# EAGLE design SmartEVSE (EAGLE 6.6.0)
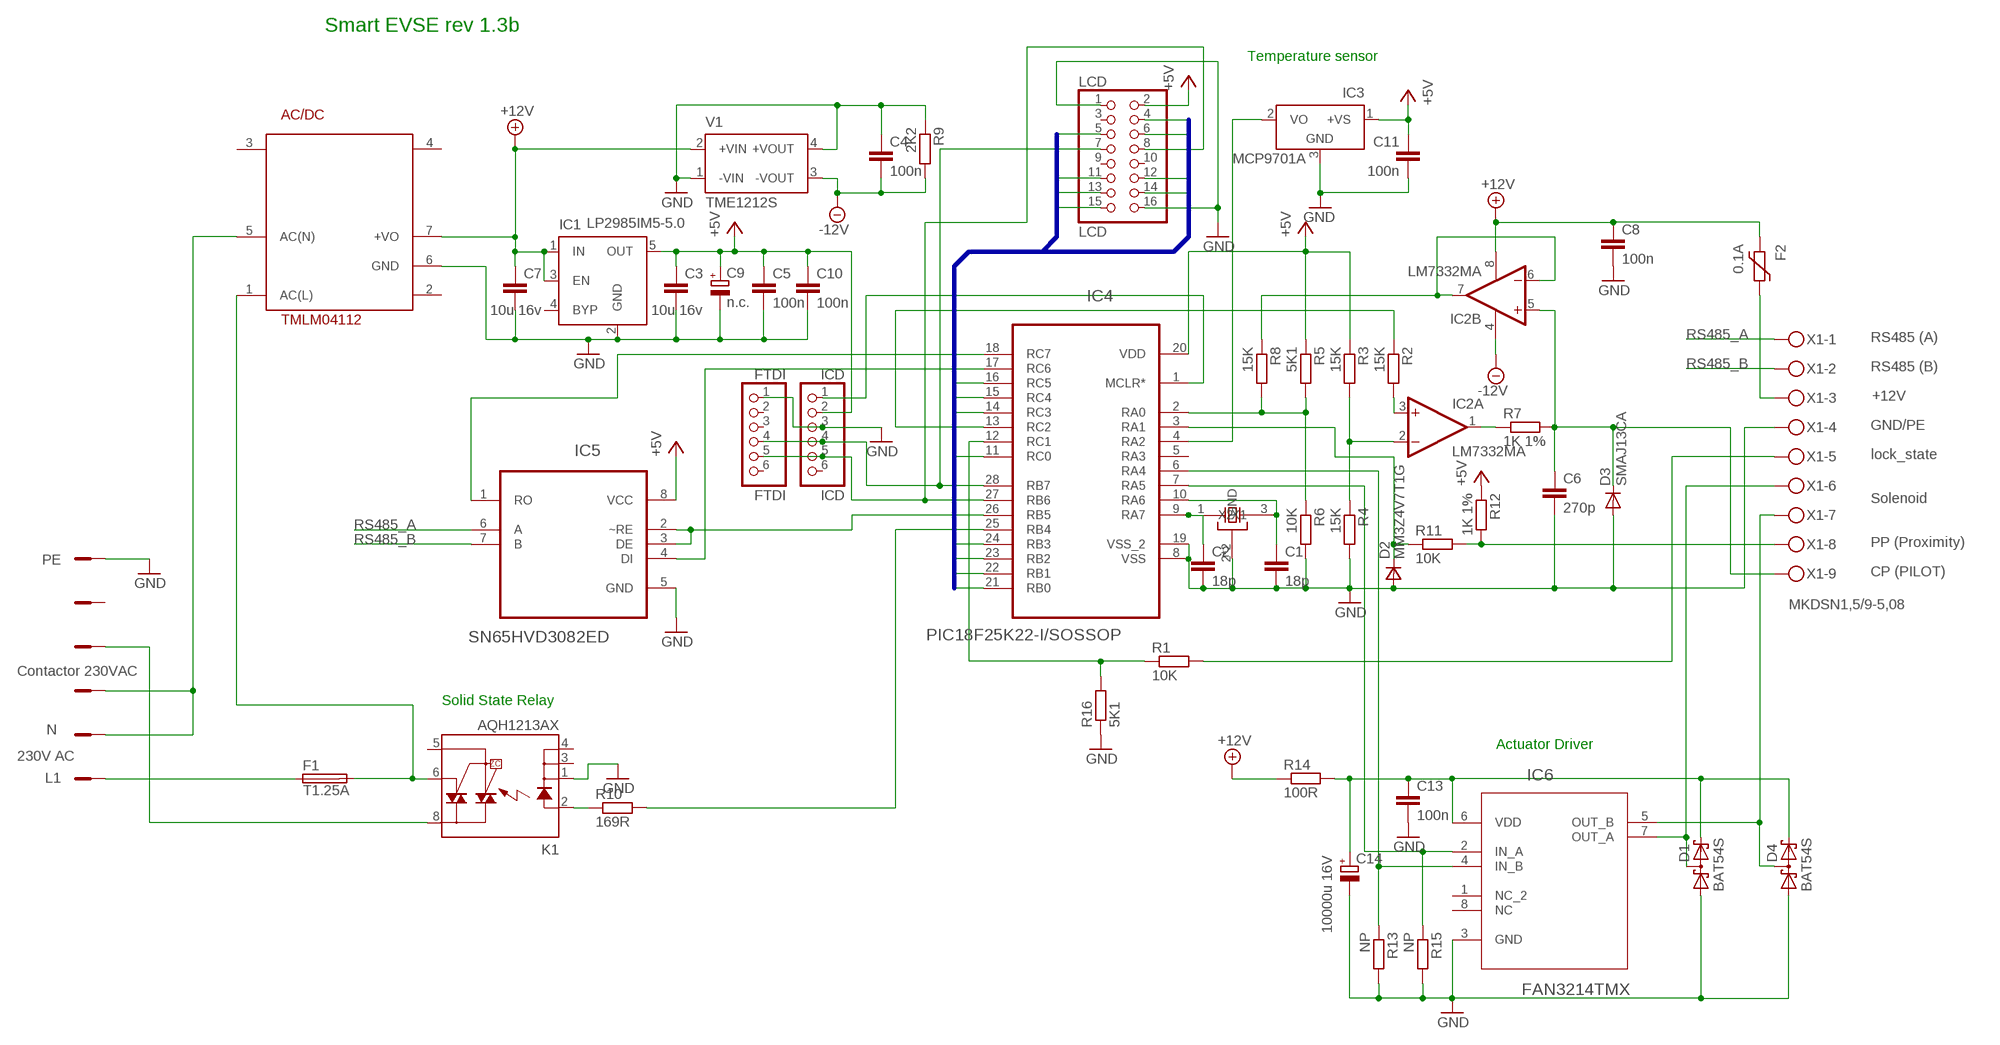
[diagram p0: schematic, sheet 1]

## Parts
AC/DC  TMLM04112  AC_DCUL  [AC/DC]
C1  18p  C-EUC0805  [C0805]
C2  18p  C-EUC0805  [C0805]
C3  10u 16v  C-EUC1206  [C1206]
C4  100n  C-EUC0805  [C0805]
C5  100n  C-EUC0805  [C0805]
C6  270p  C-EUC0805  [C0805]
C7  10u 16v  C-EUC1206  [C1206]
C8  100n  C-EUC0805  [C0805]
C9  n.c.  CPOL-EUSMCC  [SMC_C]
C10  100n  C-EUC0805  [C0805]
C11  100n  C-EUC0805  [C0805]
C13  100n  C-EUC0805  [C0805]
C14  10000u 16V  CPOL-EUE10-22.5  [EB22,5D]
D1  BAT54S  [SOT23]
D2  MM3Z4V7T1G  DSOD323  [SOD323]
D3  SMAJ13CA  DIODE-DO214AC  [DO214AC]
D4  BAT54S  [SOT23]
F1  T1.25A  TR5  [TR5]
F2  0.1A  1206L"  [1206L]
FTDI  FTDI  PINHD-1X6  [1X06]
IC1  LP2985IM5-5.0  MIC5219XX  [SOT23-5]
IC2  LM7332MA  LM1458D  [SO08]
IC3  MCP9701A  LM50  [SOT23]
IC4  PIC18F25K22-I/SOSSOP  [SOP65P780X200-28N]
IC5  SN65HVD3082ED  MAX487ECSA+  [SOIC127P600X175-8N]
IC6  FAN3214TMX  TC4424AVOA  [SOIC127P600X175-8N]
ICD  ICD  PINHD-1X6  [1X06]
K1  AQH1213AX  AQH213A  [DIL07SMD]
LCD  LCD  PINHD-2X8  [2X08]
Q1  CTS_32X25_SMD  [CTS_32X25]
R1  10K  R-EU_R0805  [R0805]
R2  15K  R-EU_R0805  [R0805]
R3  15K  R-EU_R0805  [R0805]
R4  15K  R-EU_R0805  [R0805]
R5  5K1  R-EU_R0805  [R0805]
R6  10K  R-EU_R0805  [R0805]
R7  1K 1%  R-EU_R0805  [R0805]
R8  15K  R-EU_R0805  [R0805]
R9  2K2  R-EU_R0805  [R0805]
R10  169R  R-EU_R0805  [R0805]
R11  10K  R-EU_R0805  [R0805]
R12  1K 1%  R-EU_R0805  [R0805]
R13  NP  R-EU_R0805  [R0805]
R14  100R  R-EU_R0805  [R0805]
R15  NP  R-EU_R0805  [R0805]
R16  5K1  R-EU_R0805  [R0805]
V1  TME1212S  [TME]
X1  MKDSN1,5/9-5,08  [MKDSN1,5/9-5,08]
X2  AST027-06  [P_AST027-06]

## Nets
+12V: AC/DC.7(+VO) C7.1 C8.1 F2.P$1 IC1.1(IN) IC1.3(EN) IC2.8(P:V+) R14.1 V1.2(+VIN)
-12V: C4.2 IC2.4(P:V-) R9.2 V1.3(-VOUT)
GND: AC/DC.6(GND) C1.2 C2.2 C3.2 C4.1 C5.2 C6.2 C7.2 C8.2 C9.- C10.2 C11.2 C13.2 C14.- D1.1(A1) D2.2(A) D3.A D4.1(A1) FTDI.1 IC1.2(GND) IC3.3(GND) IC4.8(VSS) IC4.19(VSS_2) IC5.5(GND) IC6.3(GND) ICD.3 K1.1(K) LCD.1 LCD.16 Q1.2(GND) Q1.4(GND) R4.2 R6.2 R9.1 R13.2 R15.2 R16.1 V1.1(-VIN) V1.4(+VOUT) X1.4 X2.P$1
LCD0: IC4.21(RB0) LCD.11
LCD1: IC4.22(RB1) LCD.12
LCD2: IC4.23(RB2) LCD.13
LCD3: IC4.24(RB3) LCD.14
LCD4: IC4.11(RC0) LCD.15
LCD6: IC4.14(RC3) LCD.4
LCD7: IC4.15(RC4) LCD.5
LCD8: IC4.16(RC5) LCD.6
N$1: IC4.12(RC1) R1.1 R16.2
N$3: IC4.6(RA4) IC6.4(IN_B) R13.1
N$5: IC4.17(RC6) IC5.4(DI)
N$6: IC4.18(RC7) IC5.1(RO)
N$7: C2.1 IC4.9(RA7) Q1.1(X1)
N$8: C1.1 IC4.10(RA6) Q1.3(X2)
N$9: IC2.2(A:-IN) R3.2 R4.1
N$10: C6.1 D3.C IC2.5(B:+IN) R7.2 X1.9
N$11: IC4.13(RC2) R2.1
N$12: IC2.3(A:+IN) R2.2
N$13: IC4.2(RA0) R5.2 R6.1 R8.2
N$14: IC2.1(A:OUT) R7.1
N$15: IC2.6(B:-IN) IC2.7(B:OUT) R8.1
N$16: D2.1(C) IC4.3(RA1) R11.1
N$17: C13.1 C14.+ D1.2(C2) D4.2(C2) IC6.6(VDD) R14.2
N$18: IC4.7(RA5) IC6.2(IN_A) R15.1
N$19: K1.2(A) R10.1
N$20: IC4.25(RB4) R10.2
N$21: AC/DC.1(AC(L)) F1.2 K1.6(DS3)
N$22: R11.2 R12.2 X1.8
N$23: K1.8(DS1) X2.P$3
N$24: F1.1 X2.P$6
N$25: IC4.26(RB5) IC5.2(~RE) IC5.3(DE)
N$26: AC/DC.5(AC(N)) X2.P$4 X2.P$5
N$27: D1.3(C1A2) IC6.7(OUT_A) X1.6
N$28: IC4.1(MCLR*) ICD.1
N$29: D4.3(C1A2) IC6.5(OUT_B) X1.7
N$31: IC3.2(VO) IC4.4(RA2)
N$32: F2.P$2 X1.3
N$33: R1.2 X1.5
N$34: FTDI.4 IC4.28(RB7) ICD.4 LCD.7
N$35: FTDI.5 IC4.27(RB6) ICD.5 LCD.8
RS485_A: IC5.6(A) X1.1
RS485_B: IC5.7(B) X1.2
VCC: C3.1 C5.1 C9.+ C10.1 C11.1 IC1.5(OUT) IC3.1(+VS) IC4.20(VDD) IC5.8(VCC) ICD.2 LCD.2 R3.1 R5.1 R12.1 ; supply symbol labelled +5V
Unconnected: AC/DC.2(NC2) AC/DC.3(NC) AC/DC.4(NC_) FTDI.2 FTDI.3 FTDI.6 IC1.4(BYP) IC4.5(RA3) IC6.1(NC_2) IC6.8(NC) ICD.6 K1.3(K1) K1.4(K2) K1.5(DS2) LCD.3 LCD.9 LCD.10 X2.P$2

## Buses
LCD[0..8]

## Notes on the sheet
- Smart EVSE rev 1.3b
- Temperature sensor
- RS485 (A)
- RS485 (B)
- +12V
- GND/PE
- lock_state
- Solenoid
- PP (Proximity)
- PE
- CP (PILOT)
- Contactor 230VAC
- Solid State Relay
- N
- Actuator Driver
- 230V AC
- L1

## Library data of the parts
AC/DC = ac_dc:AC_DC: AC/DC PSU TMLM 04112
C1-C8 C10 C11 C13 = rcl:C-EU: CAPACITOR, European symbol
C9 C14 = rcl:CPOL-EU: POLARIZED CAPACITOR, European symbol
D1 D4 = diode:BAT54S: Schottky Diodes Pin connection corrected 2011-05-04 Source: Fairchild .. BAT54.pdf
D2 = zetex:D: DIODE; MPN: CDSOD323-T05C; OC_FARNELL: 1824860; OC_NEWARK: 79R6078
D3 = diode:DIODE-: DIODE
F1 = fuse:TR5: FUSE Wickmann; OC_FARNELL: unknown; OC_NEWARK: unknown
F2 = ptc-littlefuse:1206L
FTDI ICD = pinhead:PINHD-1X6: PIN HEADER
IC1 = v-reg-micrel:MIC5219XX: VOLTAGE REGULATOR; OC_FARNELL: unknown; OC_NEWARK: unknown
IC2 = linear:*1458: OP AMP
IC3 = linear:LM50: SOT-23 Single-Supply Centigrade Temperature Sensor Vout = (10mV/°C x Temp °C) +5mmmV Source: http://cache.national.com/ds/LM/LM50.pdf
IC4 = pic_18f25k22:PIC18F25K22-I/SO: MCU 8BIT 32KB FLASH 5.5V 28SOIC
IC5 = max487:MAX487ECSA+: Low-Power, Slew-Rate-Limited RS-485/RS-422 Transceivers; MPN: MAX487ECSA+; OC_FARNELL: 9724532; OC_NEWARK: 68K4803; PACKAGE: SOIC-8; SUPPLIER: Maxim
IC6 = tc4424:TC4424AVOA: 3A Dual High-Speed Power MOSFET Drivers; DESCRIPTION: MOSFET; MPN: TC4424AVOA; OC_FARNELL: 1332307; OC_NEWARK: 56K7421; PACKAGE: SOIC-8; SUPPLIER: Microchip
K1 = relay:AQH*213: SOLID STATE RELAY NAiS Source: http://www.mew-europe.com/.. en_ds_61613_0000.pdf; OC_FARNELL: unknown; OC_NEWARK: unknown
LCD = pinhead:PINHD-2X8: PIN HEADER
Q1 = cts_crystal:CTS_32X25_SMD
R1-R16 = resistor:R-EU_: RESISTOR, European symbol
V1 = traco-electronic:TME?*: DC/DC Converter TME Series 1 Watt Source: www.tracopower.com .. tme.pdf; MPN: TME 1212S; OC_FARNELL: 1007545; OC_NEWARK: 51R5327
X1 = con-phoenix-508:MKDSN1,5/9-5,08: MKDSN 1,5/ 9-5,08 Printklemme Nennstrom: 13,5 A Nennspannung: 250 V Rastermaß: 5,08 mm Polzahl: 9 Anschlussart: Schraubanschluss Montage: Löten Anschlussrichtung Leiter/Platine: 0 ° Artikelnummer: 1729199 Source: http://eshop.phoenixcontact.com .. 1729199.pdf; MPN: SMKDSN1,5/9-5,08; OC_FARNELL: 1792912; OC_NEWARK: 70R0305
X2 = con-ria-ast027-750:AST027-06: RIA Springcon AST027-06 Grid 7,5mm Source: http://www.riaconnect.com/_assets/catalog/2008_TB_40.pdf

## Board
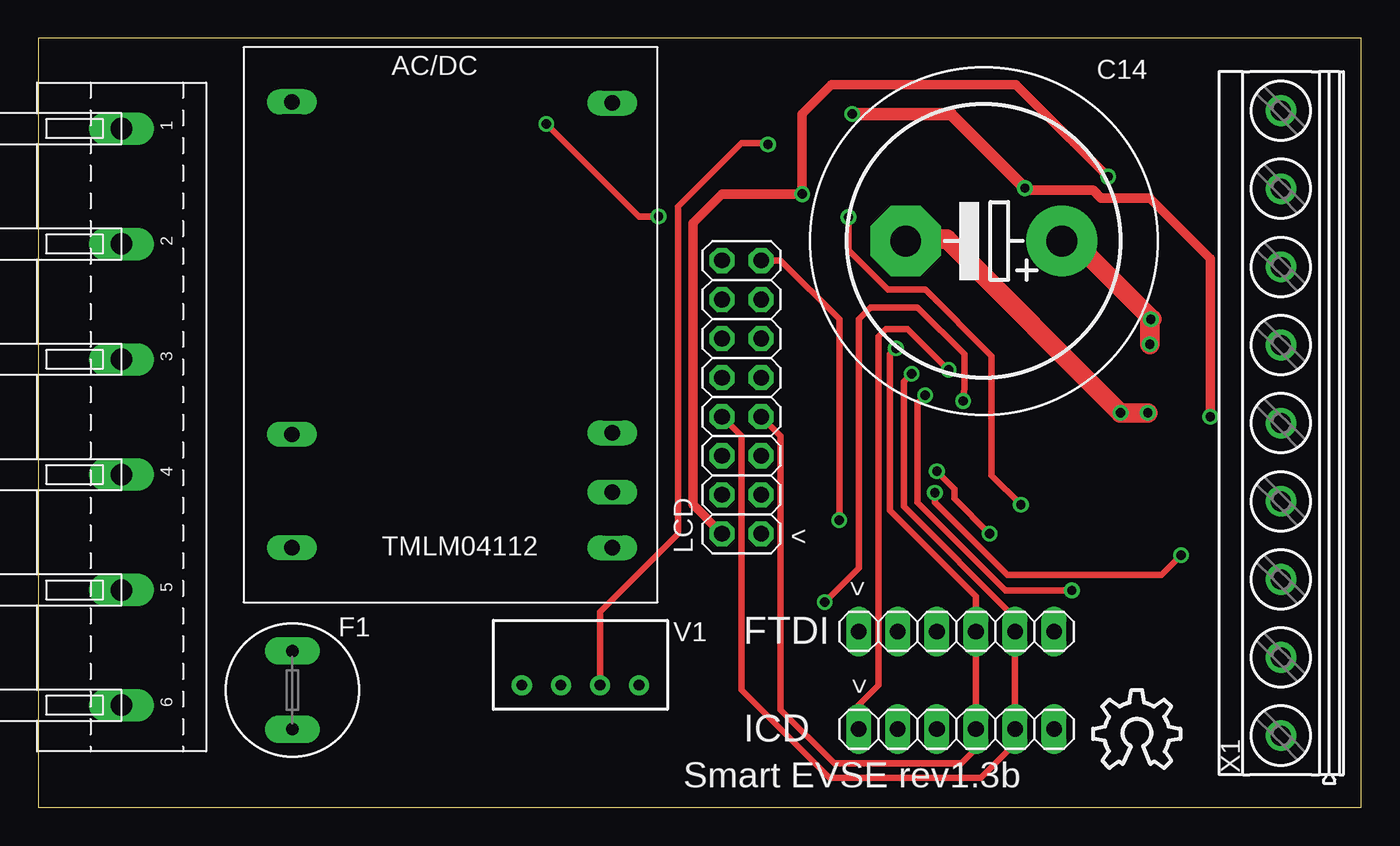
[diagram p1: board, top side]
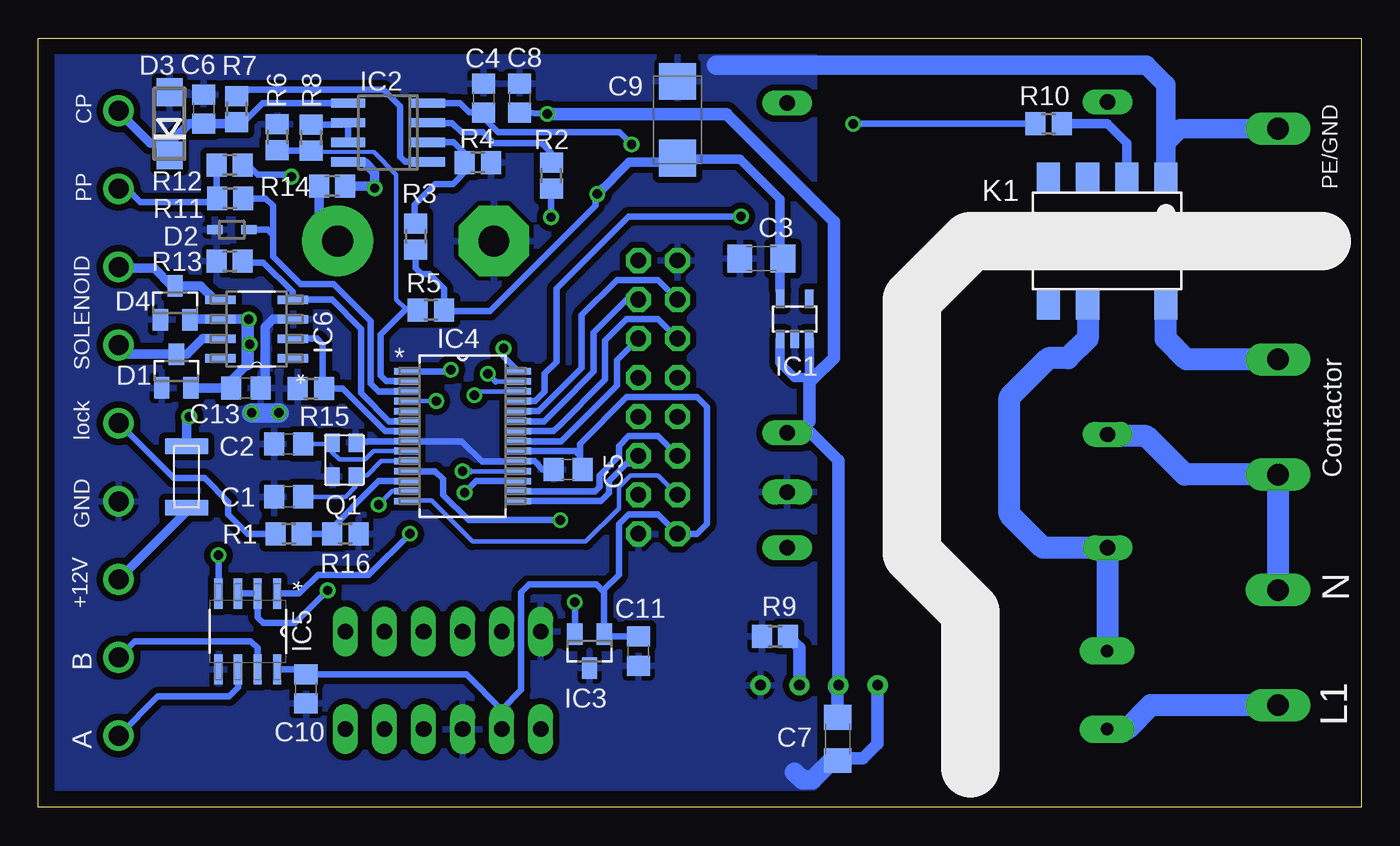
[diagram p2: board, bottom side, seen from below]

Size 86 x 50 mm. Coordinates in mm from the lower left corner, seen from the top.
Outline: 0,0 86,0 86,50 0,50 0,0
Copper layers (1*16): Top 0.035mm / dielectric 1.5mm / Bottom 0.035mm
Design rules "default": minimum track width 10mil, minimum drill 24mil, track to track 8mil, track to pad 8mil, pad to pad 8mil, via to via 8mil, smd to smd 8mil, copper to edge 40mil, drill to drill 8mil, minimum pad ring 12mil, minimum via ring 8mil, stop-mask expansion 4mil, vias tented up to drill 0mil, thermal gap 12mil

### Footprints (pad centres in the part's own frame; a part is rotated, then mirrored left to right if it is on the bottom)
AC/DC = drill 1 long: 1 3.14,3.54; 2 23.98,3.54; 3 3.14,32.54; 4 23.97,32.46; 5 3.14,10.91; 6 23.98,7.16; 7 23.98,11.01
C0805 = smd 1.3 x 1.5: 1 -0.95,0; 2 0.95,0
C1206 = smd 1.6 x 1.8: 1 -1.4,0; 2 1.4,0
SMC_C = smd 2.4 x 2.4: + -2.5,0; - 2.5,0
EB22,5D = drill 2.007 pad 4.597: + -5.08,0 | drill 2.007 pad 4.597 octagon: - 5.08,0
SOT23 = smd 1 x 1.4: 1 -0.95,-1.1; 2 0.95,-1.1; 3 0,1.1
SOD323 = smd 1 x 0.6: 1 -1.1,0; 2 1.1,0
DO214AC = smd 1.8 x 1.7: A 2.05,0; C -2.05,0
TR5 = drill 0.813 pad 1.778 long: 1 -2.54,0; 2 2.54,0
1206L = smd 1 x 2.8: P$1 -2,0; P$2 2,0
1X06 = drill 1.016 long: 1 -6.35,0; 2 -3.81,0; 3 -1.27,0; 4 1.27,0; 5 3.81,0; 6 6.35,0
SOT23-5 = smd 0.55 x 1.2: 1 -0.95,-1.3; 2 0,-1.3; 3 0.95,-1.3; 4 0.95,1.3; 5 -0.95,1.3
SO08 = smd 0.6 x 2.2: 1 -1.905,-2.6; 2 -0.635,-2.6; 3 0.635,-2.6; 4 1.905,-2.6; 5 1.905,2.6; 6 0.635,2.6; 7 -0.635,2.6; 8 -1.905,2.6
SOP65P780X200-28N = smd 1.651 x 0.432: 1 -3.632,4.216; 2 -3.632,3.581; 3 -3.632,2.921; 4 -3.632,2.286; 5 -3.632,1.626; 6 -3.632,0.965; 7 -3.632,0.33; 8 -3.632,-0.33; 9 -3.632,-0.965; 10 -3.632,-1.626; 11 -3.632,-2.286; 12 -3.632,-2.921; 13 -3.632,-3.581; 14 -3.632,-4.216; 15 3.632,-4.216; 16 3.632,-3.581; 17 3.632,-2.921; 18 3.632,-2.286; 19 3.632,-1.626; 20 3.632,-0.965; 21 3.632,-0.33; 22 3.632,0.33; 23 3.632,0.965; 24 3.632,1.626; 25 3.632,2.286; 26 3.632,2.921; 27 3.632,3.581; 28 3.632,4.216
SOIC127P600X175-8N = smd 1.981 x 0.533: 1 -2.464,1.905; 2 -2.464,0.635; 3 -2.464,-0.635; 4 -2.464,-1.905; 5 2.464,-1.905; 6 2.464,-0.635; 7 2.464,0.635; 8 2.464,1.905
SOIC127P600X175-8N' = smd 1.981 x 0.559: 1 -2.362,1.905; 2 -2.362,0.635; 3 -2.362,-0.635; 4 -2.362,-1.905; 5 2.362,-1.905; 6 2.362,-0.635; 7 2.362,0.635; 8 2.362,1.905
DIL07SMD = smd 1.5 x 1.9: 1 -3.81,-4.15; 2 -1.27,-4.15; 3 1.27,-4.15; 4 3.81,-4.15; 5 3.81,4.15; 6 1.27,4.15; 8 -3.81,4.15
2X08 = drill 1.016 octagon: 1 -8.89,-1.27; 2 -8.89,1.27; 3 -6.35,-1.27; 4 -6.35,1.27; 5 -3.81,-1.27; 6 -3.81,1.27; 7 -1.27,-1.27; 8 -1.27,1.27; 9 1.27,-1.27; 10 1.27,1.27; 11 3.81,-1.27; 12 3.81,1.27; 13 6.35,-1.27; 14 6.35,1.27; 15 8.89,-1.27; 16 8.89,1.27
CTS_32X25 = smd 1.2 x 0.9: 1 -1.1,-0.7; 2 1.1,-0.7; 3 1.1,0.8; 4 -1.1,0.8
R0805 = smd 1.3 x 1.5: 1 -0.85,0; 2 0.85,0
TME = drill 0.7 pad 1.1: 1 -3.81,0; 2 -1.27,0; 3 1.27,0; 4 3.81,0
MKDSN1,5/9-5,08 = drill 1.3 pad 2: 1 -20.341,0.025; 2 -15.261,0.025; 3 -10.181,0.025; 4 -5.101,0.025; 5 -0.021,0.025; 6 5.059,0.025; 7 10.139,0.025; 8 15.219,0.025; 9 20.299,0.025
P_AST027-06 = drill 1.4 long: P$1 -19.05,0; P$2 -11.55,0; P$3 -4.05,0; P$4 3.45,0; P$5 10.95,0; P$6 18.45,0

### Placement (x,y rotation side)
AC/DC  13.34,13.34 0 top
C1  69.72,20.19 180 bottom
C2  69.72,23.62 180 bottom
C3  38.99,35.69 180 bottom
C4  57.05,46.12 270 bottom
C5  51.56,21.97 180 bottom
C6  75.25,45.4 90 bottom
C7  34.04,4.45 270 bottom
C8  54.71,46.12 90 bottom
C9  44.45,44.7 90 bottom
C10  68.61,7.7 270 bottom
C11  46.99,10.16 270 bottom
C13  72.51,27.26 0 bottom
C14  61.47,36.83 180 top
D1  77.03,28.37 0 bottom
D2  73.43,37.56 180 bottom
D3  77.47,44.45 90 bottom
D4  77.11,32.81 0 bottom
F1  16.51,7.62 90 top
F2  76.37,21.49 270 bottom
FTDI  59.69,11.43 0 top
IC1  36.83,31.75 0 bottom
IC2  63.27,43.88 90 bottom
IC3  50.16,10.16 180 bottom
IC4  58.42,24.13 0 bottom
IC5  72.39,11.43 270 bottom
IC6  FAN3214TMX  [SOIC127P600X175-8N']  71.81,31.1 180 bottom
ICD  59.69,5.08 0 top
K1  16.51,36.83 180 bottom
LCD  45.72,26.67 90 top
Q1  66.17,22.61 270 bottom
R1  69.72,17.78 180 bottom
R2  52.65,41.08 90 bottom
R3  61.47,37.12 90 bottom
R4  57.43,41.93 0 bottom
R5  60.49,32.35 180 bottom
R6  70.47,43.59 90 bottom
R7  73.11,45.4 270 bottom
R8  68.27,43.55 270 bottom
R9  38.1,11.11 0 bottom
R10  20.32,44.45 180 bottom
R11  73.54,39.6 180 bottom
R12  73.56,41.76 180 bottom
R13  73.56,35.52 180 bottom
R14  66.91,40.4 180 bottom
R15  68.29,27.22 180 bottom
R16  66.04,17.78 180 bottom
U$1  [OSHW_10X200_NOTEXT]  68.58,2.54 0 top
V1  35.24,7.94 0 top
X1  80.82,25 90 top
X2  5.4,25.08 270 top

### Tracks (layer width: path | path; a pad name or v marks a point on that pad's centre or on a via)
+12V  (via drill 0.61)
  Top 0.61: v76.2,25.4 76.2,35.69 72.26,39.62 69.09,39.62 68.58,40.13 64.27,40.13 v64.14,40.26
  Top 0.813: v52.91,45.09 59.32,45.09 v64.14,40.26
  Bottom 0.305: 35.62,27.88 35.56,27.94
  Bottom 0.406: C8.1 54.26,45.17 v52.91,45.09 | IC2.8 64.83,41.98 64.77,41.91
  Bottom 0.61: F2.P$1 76.37,25.23 v76.2,25.4 | IC1.1 37.78,28.89 36.83,27.94 36.2,27.94 35.88,27.62 | IC1.3 35.88,28.26 35.56,27.94 | 64.77,41.91 64.14,41.28 v64.14,40.26 64.28,40.4 R14.1
  Bottom 0.813: v52.91,45.09 41.27,45.09 34.29,38.1 34.29,29.21 35.56,27.94 35.88,27.62 35.88,25.08 36.2,24.77 | AC/DC.7 36.62,24.34 36.2,24.77 | V1.2 33.97,22.54 36.2,24.77 | 34.04,7.87 C7.1
  Bottom 1.27: 34.04,7.87 V1.2
-12V  (via drill 0.61)
  Top 0.406: V1.3 36.51,12.7 41.59,17.78 41.59,39.05 45.72,43.18 47.37,43.18 v47.43,43.12
  Bottom 0.406: IC2.4 58.59,45.78 58,45.2 57.08,45.2 C4.2 57.05,44.85 56.1,43.9 48.22,43.9 v47.43,43.12
  Bottom 0.813: V1.3 36.51,10.38 R9.2
GND  (via drill 0.61)
  Top 1.27: v72.14,25.65 v70.36,25.65 59.05,36.96 57.78,36.96 C14.-
  Bottom 0.305: C14.- 57.15,36.83
  Bottom 0.406: C5.2 53.21,21.97 53.75,22.5 IC4.19 54.81,22.48 57.15,22.48 58.47,23.8 IC4.8 65.27,23.8 Q1.4
  Bottom 0.61: IC6.3 70.75,31.74 71.25,31.24 71.25,27.57 C13.2
  Bottom 0.813: V1.1 31.43,4.13 32.38,3.17 33.91,3.17 C7.2
  Bottom 1.27: v70.36,25.65 v72.14,25.65 | X2.P$1 11.75,44.13 12.7,43.18 K1.1 12.7,46.99 13.97,48.26 41.91,48.26 | C7.2 34.42,3.04 35.69,1.78 36.32,1.78 36.83,2.29
  pour Bottom (isolate 0.406): 35.56,49.53 85.09,49.53 85.09,1.27 35.56,1.27
LCD0
  Bottom 0.406: LCD.11 48.39,29.08 48.39,27.43 52.02,23.8 IC4.21
LCD1
  Bottom 0.406: LCD.12 45.72,31.75 47.75,31.75 49.15,30.35 49.15,27.81 52.2,24.77 52.5,24.46 IC4.22
LCD2
  Bottom 0.406: LCD.13 47.75,33.02 49.91,30.86 49.91,28.32 52.2,26.04 53.14,25.09 IC4.23
LCD3
  Bottom 0.305: 54.76,25.78 IC4.24
  Bottom 0.406: LCD.14 45.72,34.29 48.39,34.29 50.67,32 50.67,28.57 53.47,25.78 54.76,25.78
LCD4  (via drill 0.61)
  Top 0.406: LCD.15 48.26,35.56 52.07,31.75 v52.07,18.67
  Bottom 0.406: IC4.11 60.2,21.84 59.69,21.34 59.69,20.32 58.04,18.67 v52.07,18.67
LCD6
  Bottom 0.305: LCD.4 45.72,21.59 47.5,21.59 48.26,20.83 48.26,19.43 50.42,17.27 57.78,17.27 60.45,19.94 62.03,19.94 IC4.14
LCD7
  Bottom 0.406: LCD.5 47.5,22.35 47.75,22.35 48.9,21.21 48.9,20.45 49.43,19.91 IC4.15
LCD8
  Bottom 0.406: LCD.6 45.72,24.13 47.62,24.13 48.26,23.5 48.26,22.86 49.53,21.59 49.53,20.83 49.81,20.55 IC4.16
N$1
  Bottom 0.406: IC4.12 63.88,21.21 67.31,17.78 | 67.31,17.78 R1.1 69,17.78 | 67.31,17.78 R16.2
N$3
  Bottom 0.406: 69.37,33.08 IC6.4 | IC6.4 69.84,33.01 | IC6.4 69.47,33.03 69.47,33.53 71.37,35.43 72.63,35.43 R13.1 | IC6.4 66.92,33.01 65.02,31.11 65.02,26.92 63.2,25.09 IC4.6
N$5  (via drill 0.61)
  Top 0.406: v74.3,16.38 73.03,15.11 62.99,15.11 58.29,19.81 v58.29,20.45
  Bottom 0.406: IC5.4 74.3,14.8 v74.3,16.38 | IC4.17 57.53,21.21 v58.29,20.45
N$6  (via drill 0.61)
  Top 0.406: v61.85,17.78 59.56,20.07 59.56,20.7 v58.42,21.84
  Bottom 0.305: IC4.18 57.91,21.84
  Bottom 0.406: IC5.1 69.04,13.89 67.82,15.11 64.52,15.11 v61.85,17.78 | v58.42,21.84 57.91,21.84
N$7
  Bottom 0.305: IC4.9 64.21,23.16 64.77,22.61 66.42,22.61 66.93,23.11 66.93,23.64 Q1.1 66.95,23.62 C2.1
N$8
  Bottom 0.305: IC4.10 63.73,22.5 64.64,21.59 65.28,21.59 Q1.3 65.37,20.87 66.04,20.19 C1.1
N$9
  Bottom 0.406: 61.05,43.24 IC2.2 58.99,43.24 58.29,42.55 58.29,41.94 R4.1 58.28,41.29 59.05,40.51 60.22,40.51 61.54,39.19 61.54,38.05 R3.2
N$10
  Bottom 0.406: IC2.5 71.42,45.78 72.4,44.8 72.86,44.8 R7.2
  Bottom 0.61: R7.2 72.81,44.45 C6.1 76.2,44.45 77.47,43.18 | 77.47,43.18 D3.C | X1.9 80.8,45.23 78.74,43.18 77.47,43.18
N$11  (via drill 0.61)
  Top 0.406: v52.67,38.38 52.67,36.23 55.24,33.66 57.66,33.66 61.98,29.34 61.98,21.59 v63.88,19.68
  Bottom 0.305: IC4.13 62.08,20.57 62.99,20.57 v63.88,19.68
  Bottom 0.406: v52.67,38.38 52.67,39.01 R2.1
N$12
  Bottom 0.406: 60.59,44.52 IC2.3 60.66,44.5 59.1,44.5 58.5,43.9 57.1,43.9 56.4,43.2 53.3,43.2 52.7,42.6 52.7,41.98 R2.2
N$13
  Bottom 0.254: 67.84,42.6 67.84,42.65 67.82,42.67 | 64.19,42.61 68.17,42.61 R8.2
  Bottom 0.305: R8.2 67.94,42.7 67.84,42.6 | 64.19,42.61 62.74,41.15 62.74,33.02 62.1,32.38 61.38,32.38 R5.2 61.41,31.88
  Bottom 0.406: R8.2 70.41,42.7 R6.1 | IC4.2 63.4,27.71 63.75,28.07 63.75,30.73 62.1,32.38
N$14
  Bottom 0.406: R7.1 72.29,46.67 63.57,46.67 62.5,45.6 62.5,42.3 62.17,41.98 IC2.1
N$15
  Bottom 0.406: IC2.7 IC2.6 65.99,44.4 R8.1
N$16
  Bottom 0.406: R11.1 71.22,39.6 70.74,39.12 70.74,37.21 | IC4.3 63.88,27.05 64.39,27.56 64.39,31.62 66.8,34.04 68.96,34.04 70.74,35.81 70.74,37.21 | D2.1 71.09,37.56 70.74,37.21
N$17  (via drill 0.61)
  Top 1.27: v72.26,30.1 72.26,31.62 72.39,31.75 67.56,36.58 66.8,36.58 C14.+
  Bottom 0.61: v72.33,31.73 v72.33,31.74 IC6.6 76.13,31.74 D4.2 | 72.41,28.81 73.41,27.81 73.41,27.31 C13.1 D1.2 | R14.2 67.75,38.04 C14.+
  Bottom 0.813: v72.33,31.73 72.41,31.65 72.41,30.24 v72.26,30.1 72.41,29.95 72.41,28.81
N$18
  Bottom 0.406: IC6.2 67.89,30.47 67.51,30.08 67.51,27.29 R15.1 | R15.1 67.4,27.18 67.27,27.05 | IC4.7 63.45,24.46 66.21,27.22 R15.1
N$19
  Bottom 0.61: R10.1 16.51,44.45 15.24,43.18 K1.2
N$20  (via drill 0.61)
  Top 0.406: v33.02,44.45 39.05,38.42 v40.32,38.42
  Bottom 0.406: R10.2 v33.02,44.45 | v40.32,38.42 47.62,38.42 52.32,33.72 52.32,28.96 53.09,28.19 53.09,27.05 53.72,26.42 IC4.25
N$21
  Bottom 1.422: K1.6 17.78,30.48 19.05,29.21 20.32,29.21 22.86,26.67 22.86,19.05 20.68,16.88 AC/DC.1 16.51,16.88 F1.2
N$22
  Bottom 0.406: R12.2 74.41,39.61 R11.2 74.62,39.37 79.38,39.37 80.22,40.22 X1.8
N$23
  Bottom 1.422: X2.P$3 11.35,29.13 12.7,30.48 K1.8
N$24
  Bottom 1.422: X2.P$6 13.69,6.63 15.24,5.08 F1.1
N$25  (via drill 0.61)
  Top 0.406: v67.2,14.1 62.86,14.1 57.15,19.81 57.15,26.29 v57.66,26.8
  Bottom 0.305: IC4.26 57.4,27.05 v57.66,26.8
  Bottom 0.406: IC5.3 IC5.2 71.75,12.36 71.4,12 69.3,12 v67.2,14.1
N$26
  Bottom 1.422: X2.P$5 X2.P$4 11.47,21.63 13.97,24.13 15.72,24.13 AC/DC.5
N$27
  Bottom 0.406: 74.23,30.53 IC6.7
  Bottom 0.61: IC6.7 75.31,30.48 76.33,29.47 D1.3 80.2,29.47 X1.6
N$28  (via drill 0.61)
  Top 0.406: ICD.1 53.34,6.67 54.61,7.94 54.61,30.61 55.12,31.11 56.52,31.11 v59.18,28.45
  Bottom 0.406: IC4.1 59.28,28.35 v59.18,28.45
N$29
  Bottom 0.61: IC6.5 74.54,33.01 75.44,33.91 D4.3 77.34,33.91 78.49,35.05 80.71,35.05 X1.7
N$31  (via drill 0.61)
  Top 0.406: v51.12,13.34 53.34,15.56 53.34,31.75 54.1,32.51 57.15,32.51 60.2,29.46 60.2,27.37 v60.13,26.42
  Bottom 0.305: IC4.4 v60.13,26.42
  Bottom 0.406: v51.12,13.34 IC3.2
N$32
  Bottom 0.61: F2.P$2 76.37,19.24 X1.3
N$33
  Bottom 0.406: X1.5 77.22,21.4 75.2,21.4 73.66,19.86 73.66,19.05 72.39,17.78 R1.2
N$34  (via drill 0.61)
  Top 0.406: LCD.7 48.26,24.13 48.26,6.35 51.75,2.86 60.01,2.86 60.96,3.81 ICD.4 FTDI.4 60.96,13.72 55.37,19.3 55.37,29.46 v55.75,29.84
  Bottom 0.406: v55.75,29.84 55.75,29.31 IC4.28
N$35  (via drill 0.61)
  Top 0.406: LCD.8 45.72,24.13 45.72,7.62 51.44,1.91 61.28,1.91 63.5,4.13 ICD.5 FTDI.5 63.5,12.32 56.26,19.56 56.26,27.69 v56.77,28.19
  Bottom 0.305: 56.26,27.69 54.81,27.69 IC4.27
  Bottom 0.406: v56.77,28.19 56.26,27.69
RS485_A
  Bottom 0.406: IC5.6 73,8.94 73,7.8 73.6,7.2 78.25,7.2 X1.1
RS485_B
  Bottom 0.406: IC5.7 71.75,10.36 72.2,10.8 79.73,10.8 X1.2
VCC  (via drill 0.61)
  Top 0.61: LCD.2 42.55,19.68 42.55,37.97 44.45,39.88 v49.66,39.88 49.66,45.09 51.56,46.99 63.56,46.99 v69.55,41.01
  Bottom 0.406: ICD.2 55.88,6.35 | 55.88,6.35 54.61,7.62 54.61,13.97 54.1,14.48 49.72,14.48 49.22,13.97 | 49.22,13.97 IC3.1 49.06,11.11 C11.1 | IC5.8 68.68,8.97 C10.1 58.18,8.65 55.88,6.35 | R12.1 72.37,41.76 71.75,41.15 69.69,41.15 v69.55,41.01 | 49.22,13.97 49.22,14.16 48.26,15.11 48.26,18.41 47.62,19.05 45.72,19.05 LCD.2 43.18,17.78 42.55,18.41 42.55,26.04 43.18,26.67 47.75,26.67 50.8,23.62 50.8,22.86 | v49.66,39.88 49.78,39.75 49.78,39.12 56.64,32.26 59.55,32.26 R5.1 59.64,33.73 60.58,34.67 61.09,34.67 61.47,35.05 R3.1 61.4,36.21 | 37.78,33.59 IC1.5 | IC4.20 51.1,23.16 50.8,22.86 | 50.8,22.86 50.8,22.16 C5.1
  Bottom 0.61: 49.28,40.26 v49.66,39.88 47.59,41.95 44.58,41.95 C9.+ 44.41,42.16 40.39,42.16 37.78,39.56 37.78,35.5 | 37.78,33.59 37.78,35.5 | 37.78,35.5 C3.1

### Text on the board
tNames: < | < | FTDI | < | ICD | Smart EVSE rev1.3b
bNames: PE/GND | CP | PP | Contactor | SOLENOID | lock | GND | N | +12V | B | L1 | A